# EAGLE design Bi-directional-shifter-v1_1 (EAGLE 6.5.0)
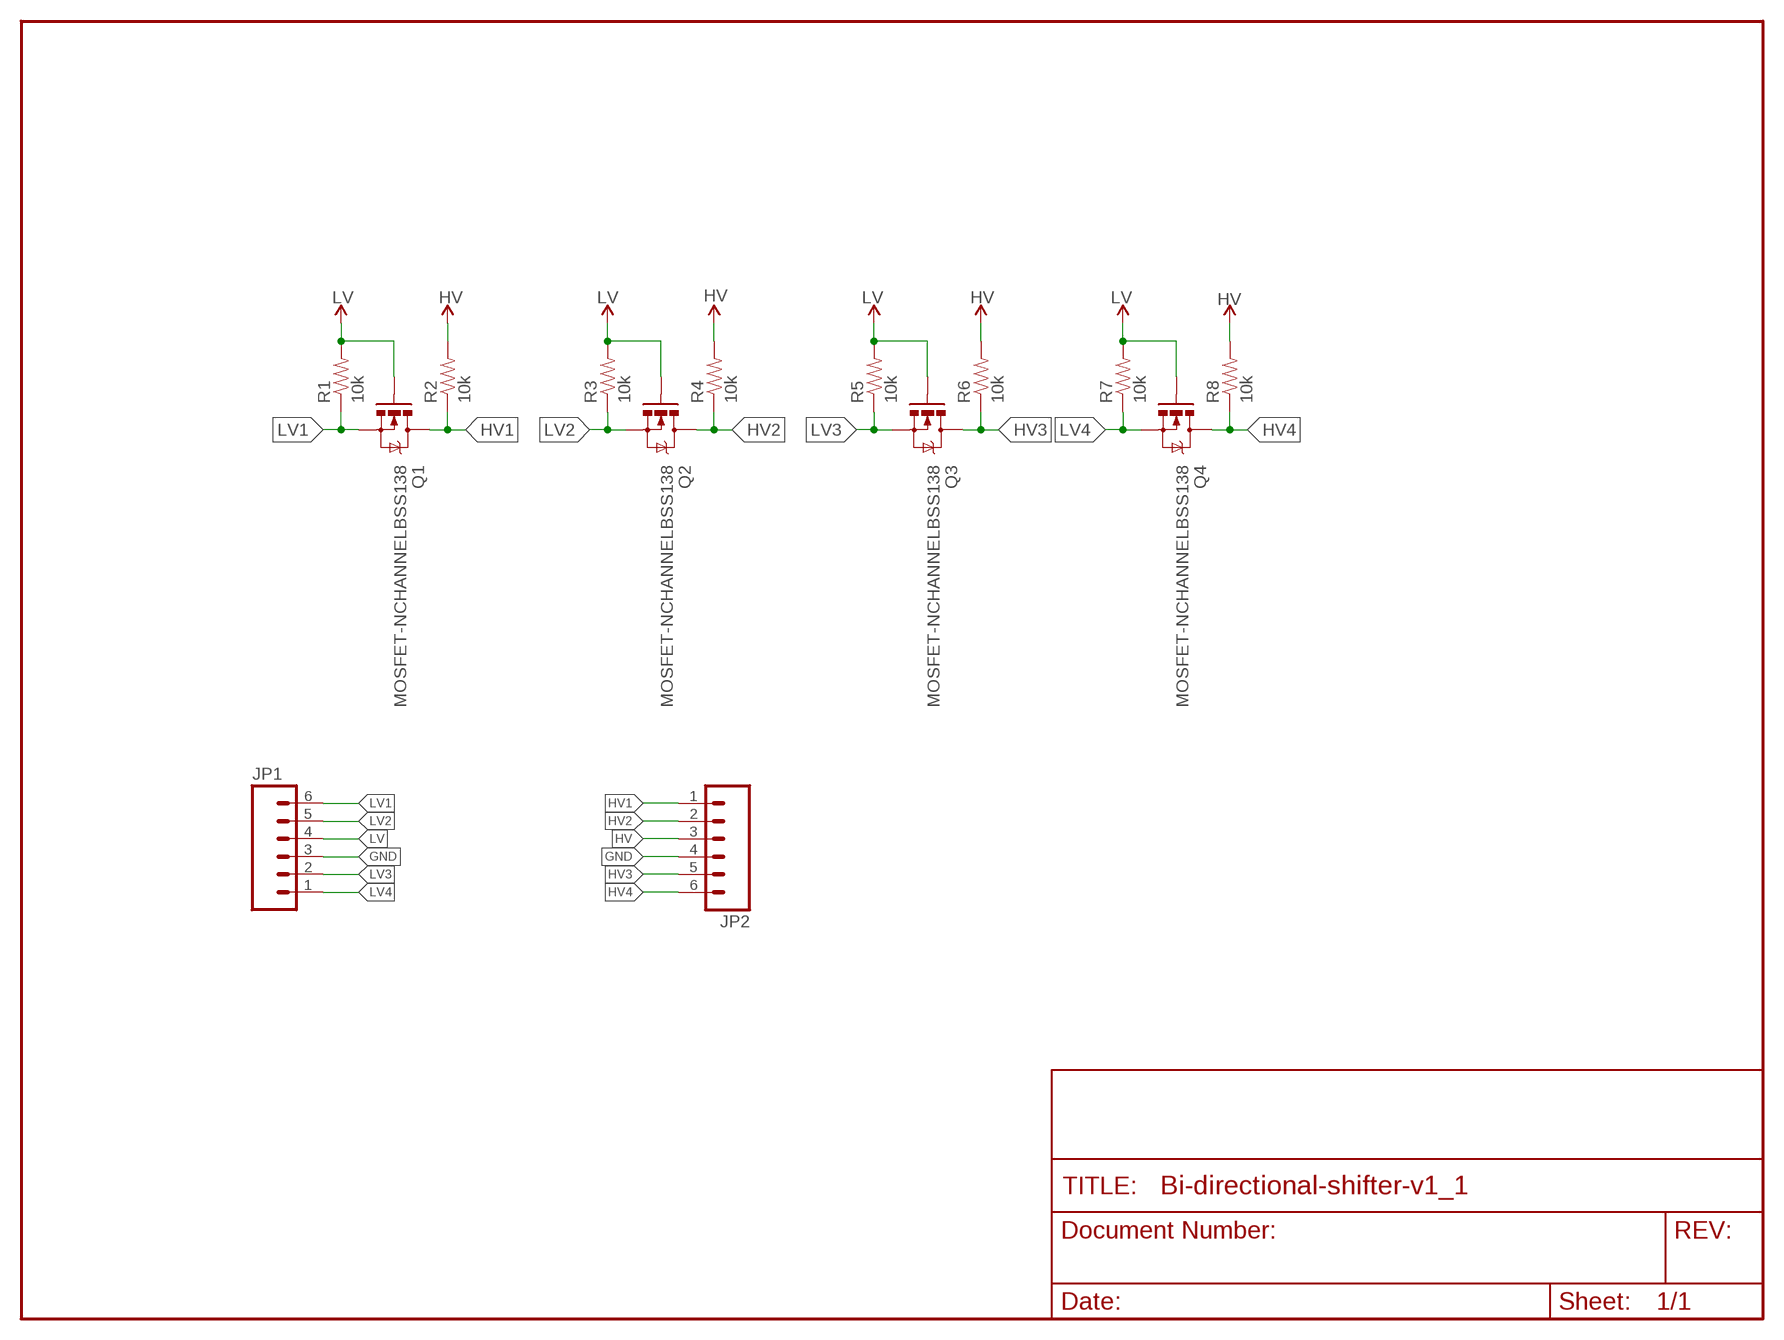
[diagram p0: schematic, sheet 1]

## Parts
JP1  M06NO_SILK  [1X06_NO_SILK]
JP2  M06NO_SILK  [1X06_NO_SILK]
Q1  MOSFET-NCHANNELBSS138  [SOT23-3]
Q2  MOSFET-NCHANNELBSS138  [SOT23-3]
Q3  MOSFET-NCHANNELBSS138  [SOT23-3]
Q4  MOSFET-NCHANNELBSS138  [SOT23-3]
R1  10k  RESISTOR0603-RES  [0603-RES]
R2  10k  RESISTOR0603-RES  [0603-RES]
R3  10k  RESISTOR0603-RES  [0603-RES]
R4  10k  RESISTOR0603-RES  [0603-RES]
R5  10k  RESISTOR0603-RES  [0603-RES]
R6  10k  RESISTOR0603-RES  [0603-RES]
R7  10k  RESISTOR0603-RES  [0603-RES]
R8  10k  RESISTOR0603-RES  [0603-RES]

## Nets
GND: JP1.3 JP2.4
HV: JP2.3 R2.2 R4.2 R6.2 R8.2 ; supply symbol labelled VCC
HV1: JP2.1 Q1.3(D) R2.1
HV2: JP2.2 Q2.3(D) R4.1
HV3: JP2.5 Q3.3(D) R6.1
HV4: JP2.6 Q4.3(D) R8.1
LV: JP1.4 Q1.1(G) Q2.1(G) Q3.1(G) Q4.1(G) R1.2 R3.2 R5.2 R7.2 ; supply symbol labelled VCC
LV1: JP1.6 Q1.2(S) R1.1
LV2: JP1.5 Q2.2(S) R3.1
LV3: JP1.2 Q3.2(S) R5.1
LV4: JP1.1 Q4.2(S) R7.1

## Notes on the sheet
- LV | HV | LV | HV | LV | HV | LV | HV

## Library data of the parts
JP1 JP2 = SparkFun-Connectors:M06: Header 6 Standard 6-pin 0.1" header. Use with straight break away headers (SKU : PRT-00116), right angle break away headers (PRT-00553), swiss pins (PRT-00743), machine pins (PRT-00117), and female headers (PRT-00115). Molex polarized connector foot print use with SKU : PRT-08094 with associated crimp pins and housings. NOTES ON THE VARIANTS LOCK and LOCK_LONGPADS... This footprint was designed to help hold the alignment of a through-hole component (i.e. 6-pin header) while soldering it into place. You may notice that each hole has been shifted either up or down by 0.005 of an inch from it's more standard position (which is a perfectly straight line). This slight alteration caused the pins (the squares in the middle) to touch the edges of the holes. Because they are alternating, it causes a "brace" to hold the component in place. 0.005 has proven to be the perfect amount of "off-center" position when using our standard breakaway headers. Although looks a little odd when you look at the bare footprint, once you have a header in there, the alteration is very hard to notice. Also,if you push a header all the way into place, it is covered up entirely on the bottom side. This idea of altering the position of holes to aid alignment will be further integrated into the Sparkfun Library for other footprints. It can help hold any component with 3 or more connection pins.
Q1-Q4 = SparkFun-DiscreteSemi:MOSFET-NCHANNEL: Common NMOSFET Parts MFG P/N Store ID Prod ID FDD8780 TRANS-09984 SI7820DN TRANS-11055 FDS6630A IC-08089 2N7002PW TRANS-11151 FQP30N06L COM-10213 TRANS-10060 BSS123LT1G TRANS-08345 BSS138 TRANS-00830 BS170 2N7000; PROD_ID: TRANS-00830
R1-R8 = SparkFun-Passives:RESISTOR: Resistor Basic schematic elements and footprints for 0603, 1206, and PTH resistors.

## Board
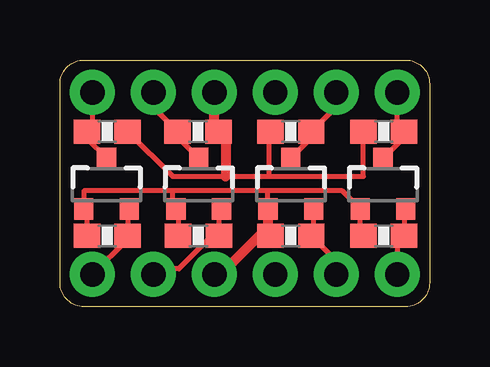
[diagram p1: board, top side]
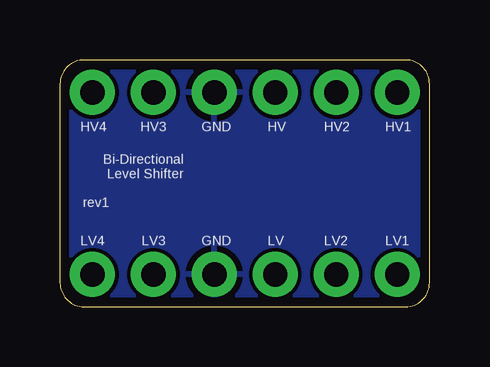
[diagram p2: board, bottom side, seen from below]

Size 15.4 x 10.28 mm. Coordinates in mm from the lower left corner, seen from the top.
Outline: 14.4,0 1,0 arc-90 0,1 0,9.28 arc-90 1,10.28 14.4,10.28 arc-90 15.4,9.28 15.4,1 arc-90 14.4,0
Copper layers (1*16): Top 0.0356mm / dielectric 1.5011mm / Bottom 0.0356mm
Design rules "LaenPCBOrder": minimum track width 6mil, minimum drill 13mil, track to track 6mil, track to pad 6mil, pad to pad 6mil, via to via 6mil, smd to smd 6mil, copper to edge 15mil, drill to drill 6mil, minimum pad ring 7mil, minimum via ring 7mil, stop-mask expansion 3mil, vias tented up to drill 0mil, thermal gap 10mil

### Footprints (pad centres in the part's own frame; a part is rotated, then mirrored left to right if it is on the bottom)
1X06_NO_SILK = drill 1.016 pad 1.88: 1 0,0; 2 2.54,0; 3 5.08,0; 4 7.62,0; 5 10.16,0; 6 12.7,0
SOT23-3 = smd 0.8 x 0.9: 1 -0.95,-1; 2 0.95,-1; 3 0,1.1
0603-RES = smd 1.1 x 1: 1 -0.85,0; 2 0.85,0

### Placement (x,y rotation side)
JP1  14.05,1.35 180 top
JP2  1.35,8.93 0 top
Q1  1.94,5.08 0 top
Q2  5.78,5.08 0 top
Q3  9.62,5.08 0 top
Q4  13.46,5.08 0 top
R1  1.97,2.96 180 top
R2  1.97,7.3 0 top
R3  5.77,2.96 180 top
R4  5.75,7.3 0 top
R5  9.62,2.96 180 top
R6  9.62,7.3 180 top
R7  13.49,2.96 180 top
R8  13.49,7.3 180 top

### Tracks (layer width: path | path; a pad name or v marks a point on that pad's centre or on a via)
GND
  pour Bottom: 0,1 0,9.28 arc-90 1,10.28 14.4,10.28 arc-90 15.4,9.28 15.4,1 arc-90 14.4,0 1,0 arc-90
HV
  Top 0.203: R2.2 4.69,5.43 6.9,5.43 8.7,5.43 | 8.7,5.43 12.64,5.43 R8.2 | R6.2 8.7,7.3 8.7,5.43 | R4.2 6.65,7.3
  Top 0.406: R4.2 6.43,7.47 JP2.3 | 6.65,7.3 6.9,7.05 6.9,5.43
HV1
  Top 0.203: JP2.1 1.35,7.53 R2.1 1.12,7 Q1.3
HV2
  Top 0.203: JP2.2 3.89,8.31 R4.1 4.9,7.06 Q2.3
HV3
  Top 0.203: Q3.3 10.47,7.03 R6.1 11.51,8.34 JP2.5
HV4
  Top 0.203: Q4.3 14.34,7.06 R8.1 14.05,7.59 JP2.6
LV
  Top 0.203: R7.2 12.51,3.09 Q4.1 11.76,4.83 8.65,4.83 | 8.65,4.83 4.7,4.83 | 4.7,4.83 0.99,4.83 Q1.1 1.12,4.08 R1.2 | 4.7,4.83 4.7,4.08 Q2.1 4.92,4.08 R3.2 | Q3.1 8.65,4.08 8.65,4.83 | Q3.1 8.77,4.08 | 8.77,3.98 Q3.1
  Top 0.406: JP1.4 6.7,1.35 8.31,2.96 R5.2 8.67,3.06 Q3.1
LV1
  Top 0.203: Q1.2 2.82,4.08 R1.1 2.82,2.82 JP1.6
LV2
  Top 0.203: Q2.2 6.62,3.97 R3.1 6.33,2.96 4.95,1.58 4.12,1.58 JP1.5
LV3
  Top 0.203: Q3.2 10.57,3.06 R5.1 11.51,1.92 JP1.2
LV4
  Top 0.203: Q4.2 14.34,4.01 R7.1 14.05,2.67 JP1.1

### Text on the board
bPlace: HV1 | HV2 | HV | GND | HV3 | HV4 | Bi-Directional / Level Shifter | rev1 | LV1 | LV2 | LV | GND | LV3 | LV4